# Altium schematic sheet alu_schem_1.SchDoc
size A; SheetNumber: 1; SheetTotal: 4
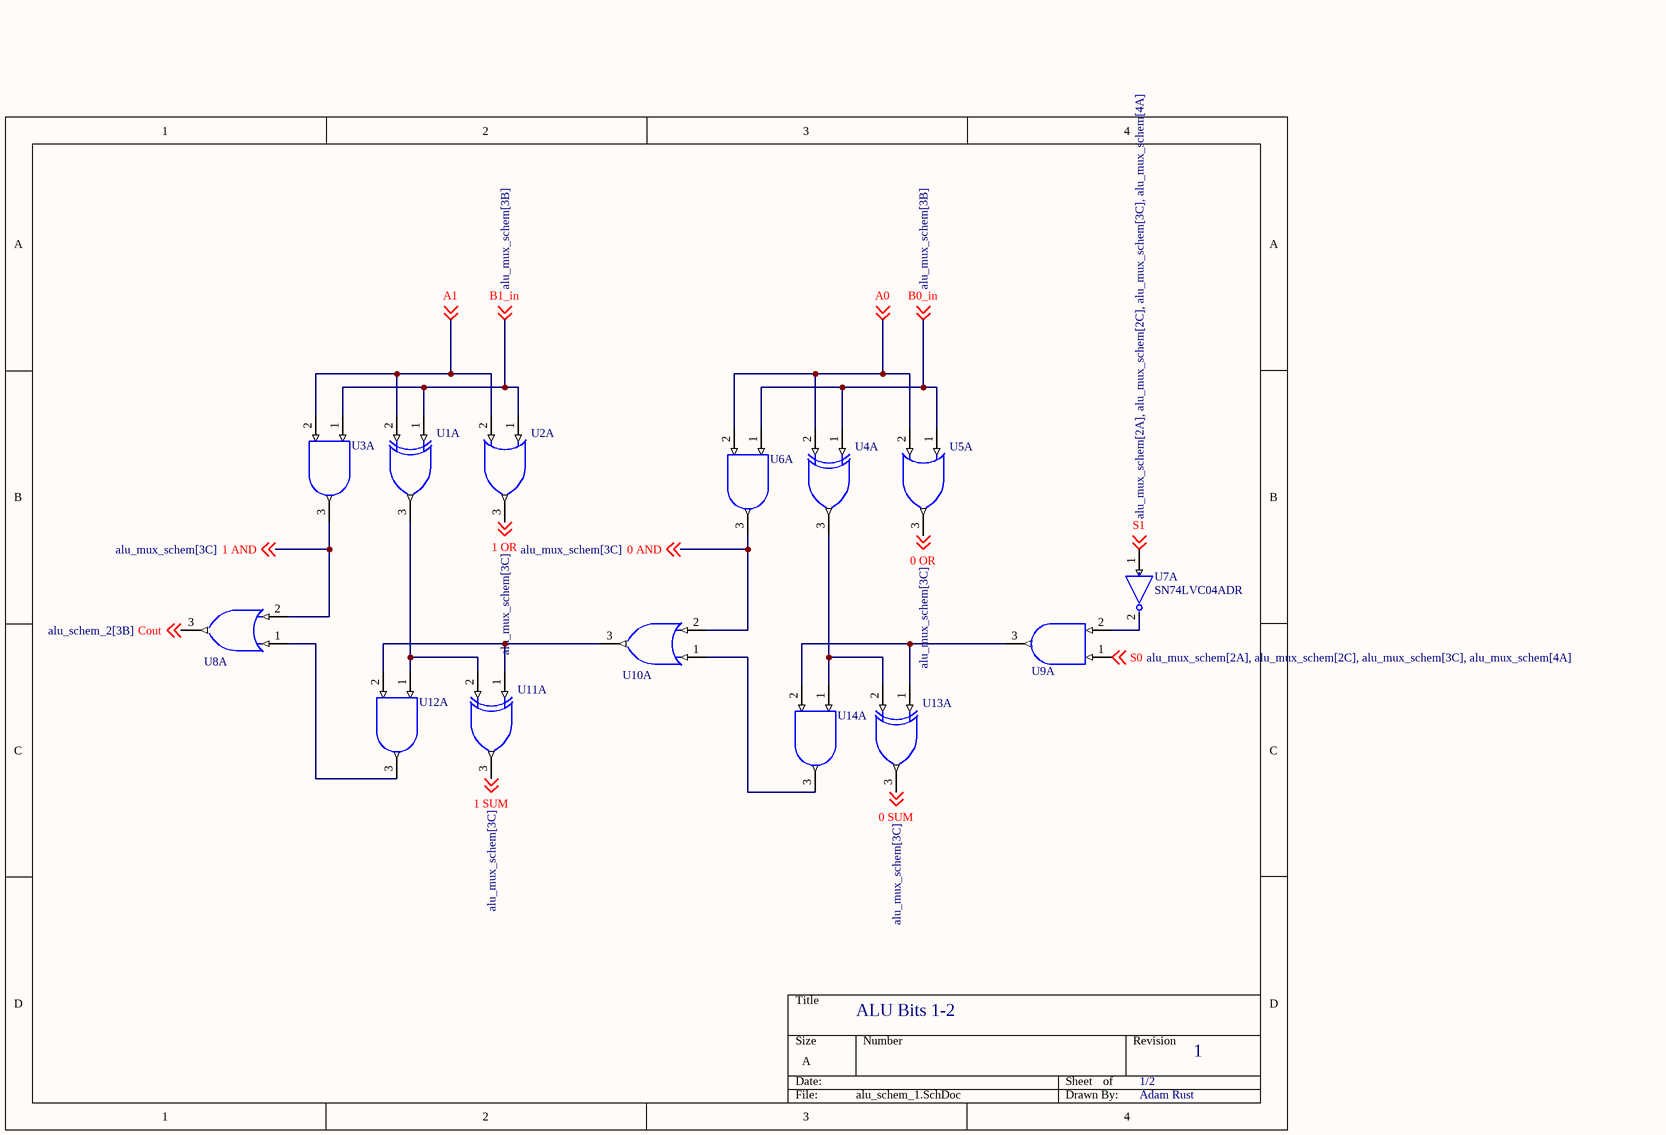
[diagram p0: alu_schem_1.SchDoc]

## Parts
U1  SN74LVC86ARGYR  [RGY0014A_V]  (value not drawn)  (part A of 5)
U2  SN74LVC32APWRG4  [PW0014A_N]  (value not drawn)  (part A of 5)
U3  SN74LVC08ADR  [D0014A_N]  (value not drawn)  (part A of 5)
U4  SN74LVC86ARGYR  [RGY0014A_V]  (value not drawn)  (part A of 5)
U5  SN74LVC32APWRG4  [PW0014A_N]  (value not drawn)  (part A of 5)
U6  SN74LVC08ADR  [D0014A_N]  (value not drawn)  (part A of 5)
U7  SN74LVC04ADR  [FP-D0014A-IPC_A]  (part A of 7)
U8  SN74LVC32APWRG4  [PW0014A_N]  (value not drawn)  (part A of 5)
U9  SN74LVC08ADR  [D0014A_N]  (value not drawn)  (part A of 5)
U10  SN74LVC32APWRG4  [PW0014A_N]  (value not drawn)  (part A of 5)
U11  SN74LVC86ARGYR  [RGY0014A_V]  (value not drawn)  (part A of 5)
U12  SN74LVC08ADR  [D0014A_N]  (value not drawn)  (part A of 5)
U13  SN74LVC86ARGYR  [RGY0014A_V]  (value not drawn)  (part A of 5)
U14  SN74LVC08ADR  [D0014A_N]  (value not drawn)  (part A of 5)

## Nets
0 AND: U6.3(1Y) U10.2(1B) ; off-sheet 0 AND
0 OR: U5.3(1Y) ; off-sheet 0 OR
0 SUM: U13.3(1Y) ; off-sheet 0 SUM
1 AND: U3.3(1Y) U8.2(1B) ; off-sheet 1 AND
1 OR: U2.3(1Y) ; off-sheet 1 OR
1 SUM: U11.3(1Y) ; off-sheet 1 SUM
A0: U4.2(1B) U5.2(1B) U6.2(1B) ; off-sheet A0
A1: U1.2(1B) U2.2(1B) U3.2(1B) ; off-sheet A1
B0_in: U4.1(1A) U5.1(1A) U6.1(1A) ; off-sheet B0_in
B1_in: U1.1(1A) U2.1(1A) U3.1(1A) ; off-sheet B1_in
Cout: U8.3(1Y) ; off-sheet Cout
S0: U9.1(1A) ; off-sheet S0
S1: U7.1(1A) ; off-sheet S1
NetU1_3: U1.3(1Y) U11.2(1B) U12.1(1A)
NetU4_3: U4.3(1Y) U13.2(1B) U14.1(1A)
NetU7_2: U7.2(1Y) U9.2(1B)
NetU8_1: U8.1(1A) U12.3(1Y)
NetU9_3: U9.3(1Y) U13.1(1A) U14.2(1B)
NetU10_1: U10.1(1A) U14.3(1Y)
NetU10_3: U10.3(1Y) U11.1(1A) U12.2(1B)

## Notes on the sheet
- ALU Bits 1-2
- 1/2
- 1
- Adam Rust

## Library data of the parts
U1 U4 U11 U13 = CMP-0778-00157-4: Quadruple 2-Input Exclusive-OR Gate, RGY0014A, LARGE T&R; Manufacturer: Texas Instruments; Bits(#): 4; Output Type: TTL; Schmitt Trigger: No; VCC(Min)(V): 1.65; tpd @ Nom Voltage(Max)(ns): 9.9,7.6,5.6,4.6; Voltage(Nom)(V): 1.8,2.5,2.7,3.3; VCC(Max)(V): 3.6; Output Drive (IOL/IOH)(Max)(mA): 24/-24; Rating: Catalog; ICC @ Nom Voltage(Max)(mA): 0.01; F @ Nom Voltage(Max)(Mhz): 70; Technology Family: LVC; PackageReference: RGY0014A; DatasheetVersion: SCAS288P; Generic Part Number: SN74LVC86A; Input Type: TTL; Operating Temperature Range(C): -40 to 125
U2 U5 U8 U10 = CMP-1573-00193-3: Quadruple 2-Input Positive-OR Gate, PW0014A, LARGE T&R; Manufacturer: Texas Instruments; ICC @ Nom Voltage(Max)(mA): 0.04; VCC(Max)(V): 3.6; F @ Nom Voltage(Max)(Mhz): 70; VCC(Min)(V): 1.65; Voltage(Nom)(V): 1.8,2.5,2.7,3.3; Input Type: TTL; Bits(#): 4; Output Drive (IOL/IOH)(Max)(mA): 24/-24; tpd @ Nom Voltage(Max)(ns): 8.7,5.4,4.4,3.8; Rating: Catalog; DatasheetVersion: SCAS286Q; Operating Temperature Range(C): -40 to 105,-40 to 125; Generic Part Number: SN74LVC32A; PackageVersion: http://www.ti.com/lit/ml/mpds360/mpds360.pdf; PackageReference: PW0014A; Code_JEDEC: MO-153; Output Type: TTL
U3 U6 U9 U12 U14 = CMP-0777-00108-3: Quadruple 2-Input Positive-AND Gate, D0014A, LARGE T&R; Manufacturer: Texas Instruments; Input Type: TTL; Output Drive (IOL/IOH)(Max)(mA): -24/24; Rating: Catalog; Technology Family: LVC; tpd @ Nom Voltage(Max)(ns): 9.8,6.9,4.8,4.1; ICC @ Nom Voltage(Max)(mA): 0.01; Voltage(Nom)(V): 1.8,2.5,2.7,3.3; F @ Nom Voltage(Max)(Mhz): 70; Schmitt Trigger: No; Bits(#): 4; VCC(Max)(V): 3.6; VCC(Min)(V): 1.65; Generic Part Number: SN74LVC08A; Output Type: TTL; DatasheetVersion: SCAS283Q; Operating Temperature Range(C): -40 to 125; PackageReference: D0014A
U7 = CMP-1615-00157-3: IC INVERTER 6CH 6-INP 14SOIC; High Level Output Current: -24mA; Number of Gates: 6; Max Supply Voltage: 3.6V; Output Current: 24mA; Quiescent Current: 1uA; Min Supply Voltage: 1.65V; Number of Inputs: 1; Logic Function: Buffer; Turn-On Delay Time: 4.5ns; Propagation Delay: 9.5ns; Number of Pins: 14; Weight: 0.004318oz; Number of Bits: 6; Number of Elements: 6; Min Operating Temperature: -40°C; Case/Package: SOIC; Technology: CMOS; Mount: Surface Mount; Package Quantity: 1; Low Level Output Current: 24mA; Radiation Hardening: No; Lead Free: Lead Free; Series: 74LVC; Max Operating Temperature: 125°C; RoHS Compliant: Yes; Packaging: Tape and Reel; REACH SVHC: No SVHC; Contact Plating: Gold; Number of Circuits: 6